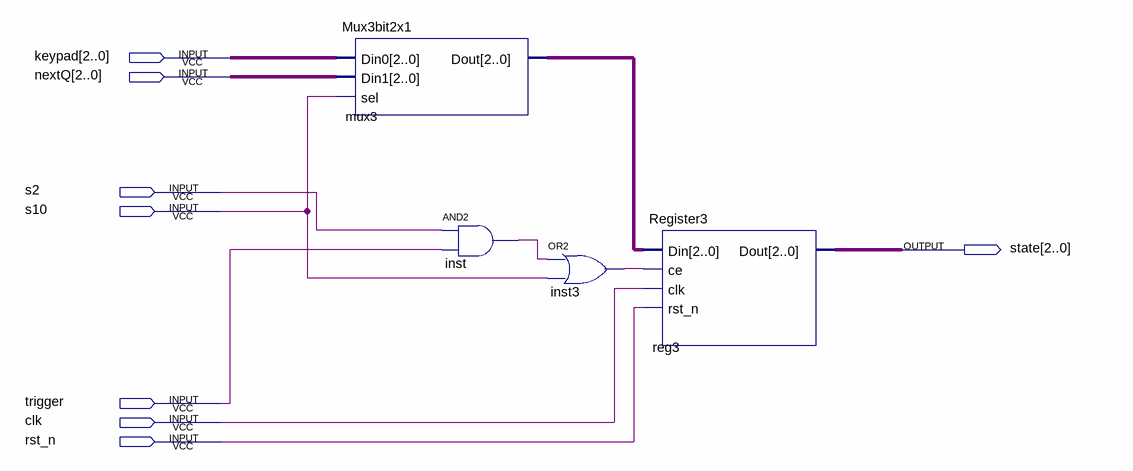
[diagram p0: schematic sheet]
// Quartus schematic StateRegister.bdf as structural Verilog: 4 symbols, 8 pins
module StateRegister (
  input  [2:0] keypad,
  input  [2:0] nextQ,
  input  s2,
  input  s10,
  input  trigger,
  input  clk,
  input  rst_n,
  output [2:0] state
);

  wire inst3_out, inst_out;
  wire [2:0] mux3_dout;

  Mux3bit2x1 mux3 (.Din0(keypad), .Din1(nextQ), .sel(s10), .Dout(mux3_dout));
  and inst (inst_out, s2, trigger);
  or inst3 (inst3_out, inst_out, s10);
  Register3 reg3 (.Din(mux3_dout), .ce(inst3_out), .clk(clk), .rst_n(rst_n), .Dout(state));
endmodule
